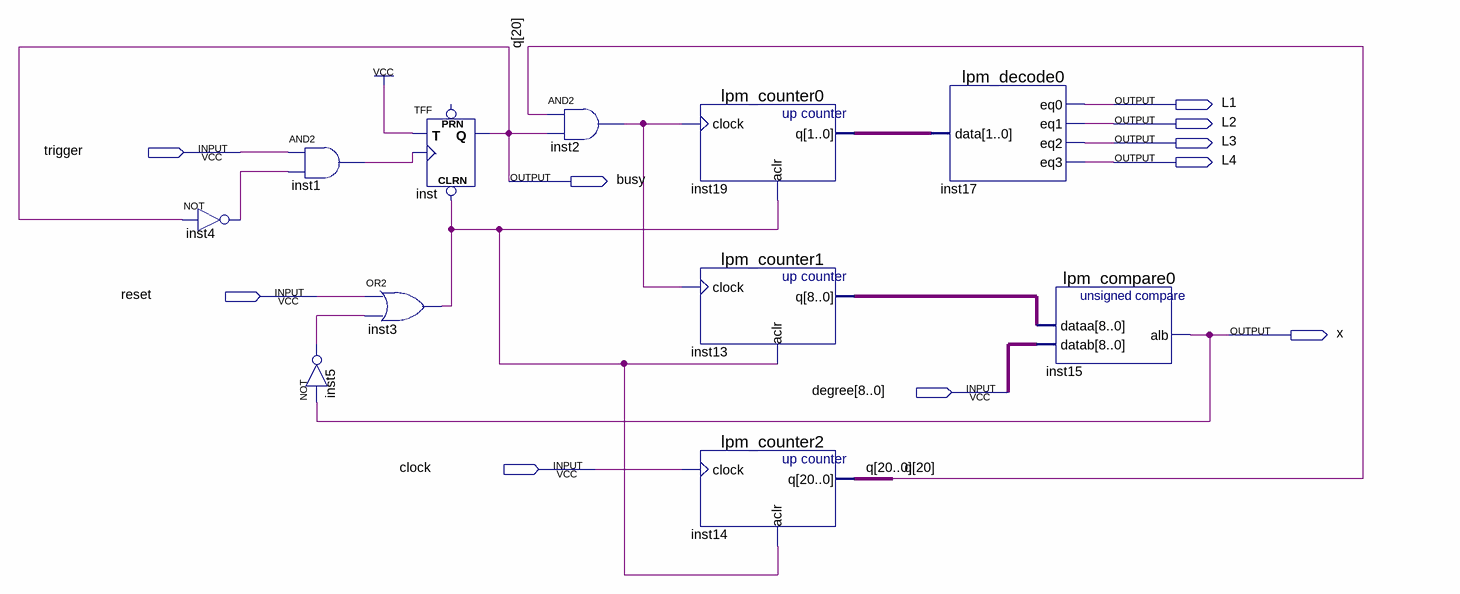
[diagram p0: schematic sheet]
// Quartus schematic Motor.bdf as structural Verilog: 11 symbols, 10 pins
module Motor (
  input  trigger,
  input  reset,
  input  [8:0] degree,
  input  clock,
  output L1,
  output L2,
  output L3,
  output L4,
  output busy,
  output x
);

  wire inst1_out, inst2_out, inst3_out, inst4_out, inst5_out;
  wire [1:0] inst19_q;
  wire [8:0] inst13_q;
  wire [20:0] q;

  not inst4 (inst4_out, busy);
  and inst1 (inst1_out, trigger, inst4_out);
  not inst5 (inst5_out, x);
  TFF inst (.CLRN(inst3_out), .T(1'b1), .CLK(inst1_out), .Q(busy));  // open: PRN
  or inst3 (inst3_out, reset, inst5_out);
  and inst2 (inst2_out, q[20], busy);
  lpm_counter0 inst19 (.clock(inst2_out), .aclr(inst3_out), .q(inst19_q));
  lpm_counter1 inst13 (.clock(inst2_out), .aclr(inst3_out), .q(inst13_q));
  lpm_counter2 inst14 (.clock(clock), .aclr(inst3_out), .q(q));
  lpm_decode0 inst17 (.data(inst19_q), .eq0(L1), .eq1(L2), .eq2(L3), .eq3(L4));
  lpm_compare0 inst15 (.dataa(inst13_q), .datab(degree), .alb(x));
endmodule
